# Altium schematic sheet Connector.SchDoc
size A4; SheetNumber: 2; SheetTotal: 2
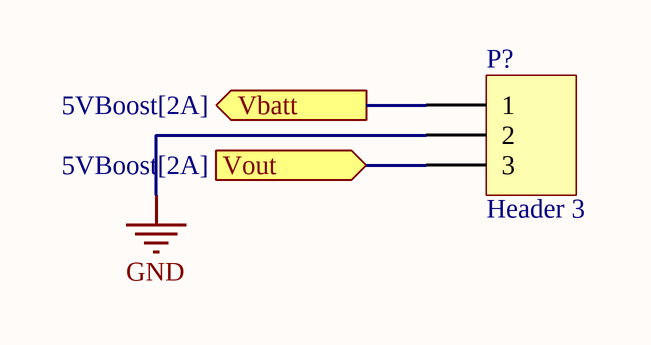
[diagram p0: Connector.SchDoc]

## Parts
P?  Header 3  [HDR1X3]

## Ports
Vbatt (out, see 5VBoost[2A]), Vout (in, see 5VBoost[2A])

## Nets
GND: P?.2
Vbatt: P?.1 ; port Vbatt
Vout: P?.3 ; port Vout

## Library data of the parts
P? = Header 3: Header, 3-Pin; LatestRevisionDate: 17-Jul-2002; LatestRevisionNote: Re-released for DXP Platform.; Publisher: Altium Limited